# Altium schematic sheet 海关全向控制器主控板电路V3_USB电路.SchDoc
size A4
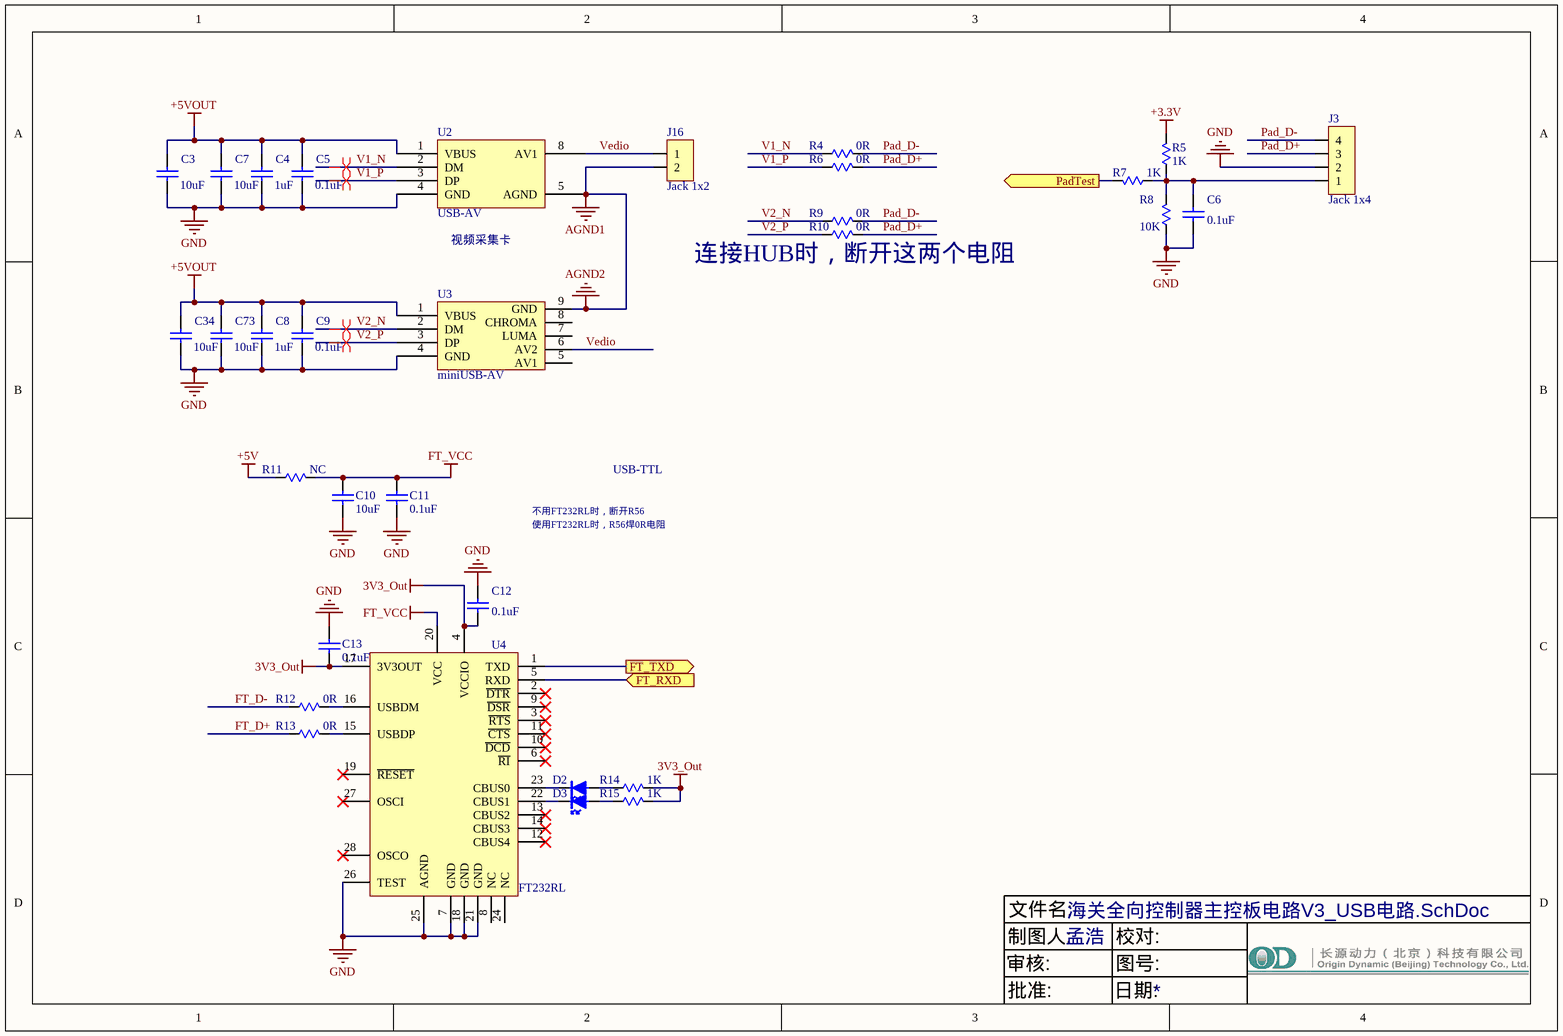
[diagram p0: 海关全向控制器主控板电路V3_USB电路.SchDoc]

## Parts
C3  10uF  [C0805]
C4  1uF  [C0805]
C5  0.1uF  [C0805]
C6  0.1uF  [C0805]
C7  10uF  [C0805]
C8  1uF  [C0805]
C9  0.1uF  [C0805]
C10  10uF  [C0805]
C11  0.1uF  [C0805]
C12  0.1uF  [C0805]
C13  0.1uF  [C0805]
C34  10uF  [C0805]
C73  10uF  [C0805]
D2  LED  [LED0603]  (value not drawn)
D3  LED  [LED0603]  (value not drawn)
J3  Jack 1x4  [35363-0460]
J16  Jack 1x2  [35363-0260]
R4  0R  [R0805]
R5  1K  [R0805]
R6  0R  [R0805]
R7  1K  [R0805]
R8  10K  [R0805]
R9  0R  [R0805]
R10  0R  [R0805]
R11  NC  [R0805]
R12  0R  [R0805]
R13  0R  [R0805]
R14  1K  [R0805]
R15  1K  [R0805]
U2  USB-AV  [USB-AV]
U3  miniUSB-AV  [miniUSB-AV]
U4  FT232RL  [SSOP-28]

## Ports
FT_RXD (in), FT_TXD (out), PadTest (out)

## Nets
3V3_Out: C12.2 C13.1 R14.1 R15.1 U4.4(VCCIO) U4.17(3V3OUT)
+3.3V: R5.1
+5V: R11.2
+5VOUT: C3.1 C4.1 C5.2 C7.1 C8.1 C9.2 C34.1 C73.1 U2.1(VBUS) U3.1(VBUS)
AGND1: J16.2 U2.5(AGND) U3.9(GND)  [also labelled AGND2]
FT_VCC: C10.1 C11.2 R11.1 U4.20(VCC)
GND: C3.2 C4.2 C5.1 C6.2 C7.2 C8.2 C9.1 C10.2 C11.1 C12.1 C13.2 C34.2 C73.2 J3.2 R8.2 U2.4(GND) U3.4(GND) U4.7(GND) U4.18(GND) U4.21(GND) U4.25(AGND) U4.26(TEST)
FT_D+: R13.2
FT_D-: R12.2
FT_RXD: U4.5(RXD) ; port FT_RXD
FT_TXD: U4.1(TXD) ; port FT_TXD
Pad_D+: J3.3 R6.1 R10.1
Pad_D-: J3.4 R4.1 R9.1
PadTest: R7.1 ; port PadTest
V1_N: R4.2 U2.2(DM)
V1_P: R6.2 U2.3(DP)
V2_N: R9.2 U3.2(DM)
V2_P: R10.2 U3.3(DP)
Vedio: J16.1 U2.8(AV1) U3.6(AV2)
NetC6_1: C6.1 J3.1 R5.2 R7.2 R8.1
NetD2_1: D2.1(A) R14.2
NetD2_2: D2.2(K) U4.23(CBUS0)
NetD3_1: D3.1(A) R15.2
NetD3_2: D3.2(K) U4.22(CBUS1)
NetR12_1: R12.1 U4.16(USBDM)
NetR13_1: R13.1 U4.15(USBDP)

Not connected (* = marked no-connect by the designer): U3 5(AV1) 7(LUMA) 8(CHROMA); U4 2(~{DTR})* 3(~{RTS})* 6(~{RI})* 8(NC) 9(~{DSR})* 10(~{DCD})* 11(~{CTS})* 12(CBUS4)* 13(CBUS2)* 14(CBUS3)* 19(~{RESET})* 24(NC) 27(OSCI)* 28(OSCO)*

## Layout directives
differential pair: V1_N, V1_P, V2_N, V2_P

## Notes on the sheet
- 视频采集卡
- (near R10) 连接HUB时，断开这两个电阻
- 不用FT232RL时，断开R56
- USB-TTL
- 使用FT232RL时，R56焊0R电阻
- 文件名:
- 审核:
- 制图人:
- 孟浩
- 校对:
- 图号:
- 批准:
- 日期:

## Library data of the parts
C3 C4 C7 C8 C10 C34 C73 = CAP: Published: 8-Jun-2000; LatestRevisionDate: 17-Jul-2002; LatestRevisionNote: Re-released for DXP Platform.; PackageReference: RAD-0.3; Publisher: Altium Limited
  C3 C7 C10 C34 C73: Value: 10uF
  C4 C8: Value: 1uF
C5 C9 C11 C13 = Cap Semi
C6 C12 = Cap: Capacitor; Value: 22pF; Published: 8-Jun-2000; Revision: July-2002: Re-released for DXP Platform.; Publisher: Altium Limited
J3 = Jack 1x4: 插座
J16 = Jack 1x2: 插座
R4-R15 = Res: Resistor; Published: 8-Jun-2000; LatestRevisionDate: 04-Mar-2005; LatestRevisionNote: PCB Footprint replaced.; PackageReference: J1-0603; Publisher: Altium Limited
  R4 R6 R9 R10 R12 R13: Value: 0R
  R5 R7 R14 R15: Value: 1K
  R8: Value: 10K
  R11: Value: NC